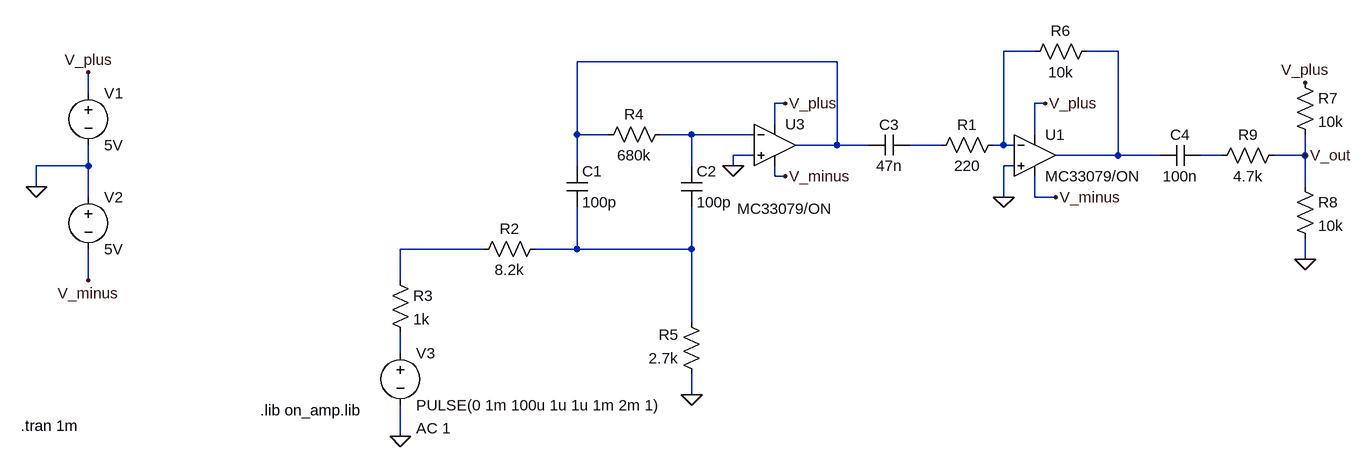
[diagram p0: schematic opamp_rec_filter_v02.asc]
opamp_rec_filter_v02.asc, the LTspice schematic file:
Version 4
SHEET 1 1332 680
WIRE 816 16 768 16
WIRE 944 16 896 16
WIRE 512 32 112 32
WIRE -640 80 -640 48
WIRE 432 96 416 96
WIRE 832 96 816 96
WIRE 416 128 416 96
WIRE 112 144 112 32
WIRE 160 144 112 144
WIRE 288 144 240 144
WIRE 384 144 288 144
WIRE 816 144 816 96
WIRE 512 160 512 32
WIRE 512 160 448 160
WIRE 560 160 512 160
WIRE 672 160 624 160
WIRE 768 160 768 16
WIRE 768 160 752 160
WIRE 784 160 768 160
WIRE 384 176 352 176
WIRE 944 176 944 16
WIRE 944 176 848 176
WIRE 1008 176 944 176
WIRE 1104 176 1072 176
WIRE 1232 176 1232 144
WIRE 1232 176 1184 176
WIRE -640 192 -640 160
WIRE -640 192 -720 192
WIRE 112 192 112 144
WIRE 288 192 288 144
WIRE 352 192 352 176
WIRE 784 192 768 192
WIRE 416 208 416 192
WIRE 432 208 416 208
WIRE -720 224 -720 192
WIRE 1232 224 1232 176
WIRE -640 240 -640 192
WIRE 768 240 768 192
WIRE 816 240 816 208
WIRE 848 240 816 240
WIRE -32 320 -160 320
WIRE 112 320 112 256
WIRE 112 320 48 320
WIRE 288 320 288 256
WIRE 288 320 112 320
WIRE 1232 336 1232 304
WIRE -640 368 -640 320
WIRE -160 368 -160 320
WIRE 288 432 288 320
WIRE -160 480 -160 448
WIRE 288 544 288 512
WIRE -160 608 -160 560
FLAG -720 224 0
FLAG -640 48 V_plus
FLAG -640 368 V_minus
FLAG -160 608 0
FLAG 432 208 V_minus
FLAG 432 96 V_plus
FLAG 848 240 V_minus
FLAG 832 96 V_plus
FLAG 768 240 0
FLAG 288 544 0
FLAG 352 192 0
FLAG 1232 336 0
FLAG 1232 64 V_plus
FLAG 1232 176 V_out
SYMBOL voltage -640 64 R0
WINDOW 123 0 0 Left 0
WINDOW 39 0 0 Left 0
SYMATTR InstName V1
SYMATTR Value 5V
SYMBOL voltage -640 224 R0
WINDOW 123 0 0 Left 0
WINDOW 39 0 0 Left 0
SYMATTR InstName V2
SYMATTR Value 5V
SYMBOL voltage -160 464 R0
WINDOW 123 24 132 Left 0
WINDOW 39 0 0 Left 0
SYMATTR Value2 AC 1
SYMATTR InstName V3
SYMATTR Value PULSE(0 1m 100u 1u 1u 1m 2m 1)
SYMBOL res -176 352 R0
SYMATTR InstName R3
SYMATTR Value 1k
SYMBOL Opamps\\opamp2 416 96 R0
WINDOW 3 -58 162 Left 0
SYMATTR Value MC33079/ON
SYMATTR InstName U3
SYMBOL Opamps\\opamp2 816 112 R0
SYMATTR InstName U1
SYMATTR Value MC33079/ON
SYMBOL res 768 144 R90
WINDOW 0 0 56 VBottom 0
WINDOW 3 32 56 VTop 0
SYMATTR InstName R1
SYMATTR Value 220
SYMBOL res 912 0 R90
WINDOW 0 0 56 VBottom 0
WINDOW 3 32 56 VTop 0
SYMATTR InstName R6
SYMATTR Value 10k
SYMBOL res 64 304 R90
WINDOW 0 0 56 VBottom 0
WINDOW 3 32 56 VTop 0
SYMATTR InstName R2
SYMATTR Value 8.2k
SYMBOL res 256 128 R90
WINDOW 0 0 56 VBottom 0
WINDOW 3 32 56 VTop 0
SYMATTR InstName R4
SYMATTR Value 680k
SYMBOL res 304 528 R180
WINDOW 0 36 76 Left 0
WINDOW 3 36 40 Left 0
SYMATTR InstName R5
SYMATTR Value 2.7k
SYMBOL cap 96 192 R0
SYMATTR InstName C1
SYMATTR Value 100p
SYMBOL cap 272 192 R0
SYMATTR InstName C2
SYMATTR Value 100p
SYMBOL cap 624 144 R90
WINDOW 0 0 32 VBottom 0
WINDOW 3 32 32 VTop 0
SYMATTR InstName C3
SYMATTR Value 47n
SYMBOL cap 1072 160 R90
WINDOW 0 0 32 VBottom 0
WINDOW 3 32 32 VTop 0
SYMATTR InstName C4
SYMATTR Value 100n
SYMBOL res 1216 48 R0
SYMATTR InstName R7
SYMATTR Value 10k
SYMBOL res 1216 208 R0
SYMATTR InstName R8
SYMATTR Value 10k
SYMBOL res 1200 160 R90
WINDOW 0 0 56 VBottom 0
WINDOW 3 32 56 VTop 0
SYMATTR InstName R9
SYMATTR Value 4.7k
TEXT -376 568 Left 0 !.lib on_amp.lib
TEXT -744 592 Left 0 !.tran 1m

The netlist it stands for:
* opamp_rec_filter_v02.asc
V1 V_plus 0 5V
V2 0 V_minus 5V
V3 N009 0 PULSE(0 1m 100u 1u 1u 1m 2m 1) AC 1
R3 N007 N009 1k
XU3 0 N004 V_plus V_minus N003 MC33079/ON  ; pins In+ In- V+ V- OUT
XU1 0 N001 V_plus V_minus N002 MC33079/ON  ; pins In+ In- V+ V- OUT
R1 N001 N005 220
R6 N002 N001 10k
R2 N008 N007 8.2k
R4 N004 N003 680k
R5 0 N008 2.7k
C1 N003 N008 100p
C2 N004 N008 100p
C3 N005 N003 47n
C4 N006 N002 100n
R7 V_plus V_out 10k
R8 V_out 0 10k
R9 V_out N006 4.7k
.lib on_amp.lib
.tran 1m
.backanno
.end